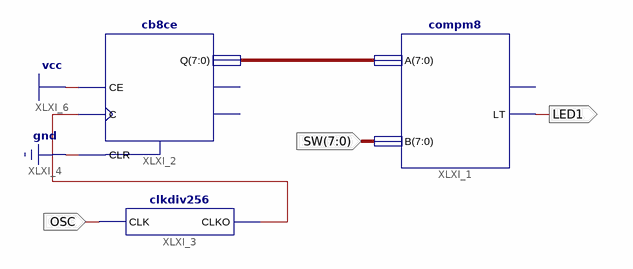
[diagram p0: schematic sheet 1]
// Xilinx ISE schematic main.sch (spartan6) as structural Verilog: 3 symbols, 3 ports
module main (
  input  [7:0] SW,
  input  OSC,
  output LED1
);

  wire XLXN_5;
  wire [7:0] XLXN_2;

  cb8ce XLXI_2 (.C(XLXN_5), .CE(1'b1), .CLR(1'b0), .Q(XLXN_2));  // open: CEO, TC
  compm8 XLXI_1 (.A(XLXN_2), .B(SW), .LT(LED1));  // open: GT
  clkdiv256 XLXI_3 (.CLK(OSC), .CLKO(XLXN_5));
endmodule
